# Altium schematic sheet [11] - CONNECTORS.SchDoc: CONNECTORS
size A4; Organization: Bjørn T. Brodtkorb; Address1: Frode Rinnans veg 161; Address2: 7050 Trondheim; DocumentNumber: 6598; Revision: 1.0; SheetNumber: 1; SheetTotal: 1
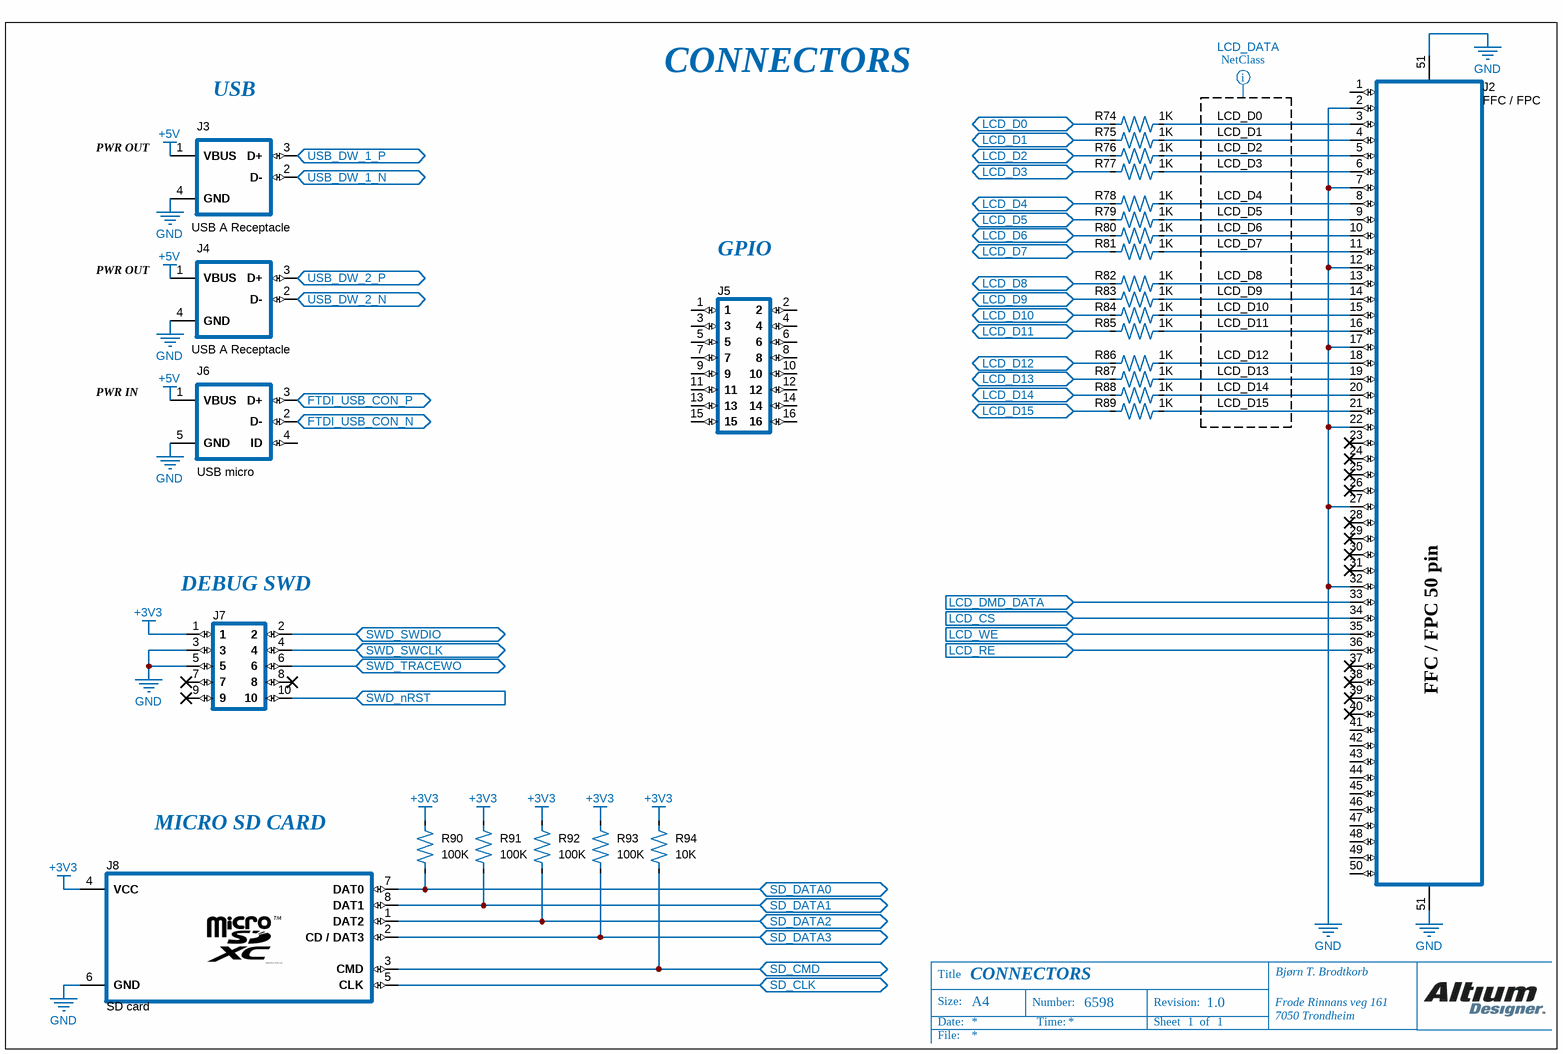
[diagram p0: [11] - CONNECTORS.SchDoc]

## Parts
J2  FFC / FPC  [5-1734592-0]
J3  USB A Receptacle  [USB A Socket]
J4  USB A Receptacle  [USB A Socket]
J5  123-34-2234_14  [Header 2x8 male]  (value not drawn)
J6  USB micro  [USB micro]
J7  123-34-2234_11_1  [Header 2x5 male 1.27mm]  (value not drawn)
J8  SD card  [47219-2001]
R74  value 1K  [R0402]  (hidden comment: CRCW04020000Z0ED)
R75  value 1K  [R0402]  (hidden comment: CRCW04020000Z0ED)
R76  value 1K  [R0402]  (hidden comment: CRCW04020000Z0ED)
R77  value 1K  [R0402]  (hidden comment: CRCW04020000Z0ED)
R78  value 1K  [R0402]  (hidden comment: CRCW04020000Z0ED)
R79  value 1K  [R0402]  (hidden comment: CRCW04020000Z0ED)
R80  value 1K  [R0402]  (hidden comment: CRCW04020000Z0ED)
R81  value 1K  [R0402]  (hidden comment: CRCW04020000Z0ED)
R82  value 1K  [R0402]  (hidden comment: CRCW04020000Z0ED)
R83  value 1K  [R0402]  (hidden comment: CRCW04020000Z0ED)
R84  value 1K  [R0402]  (hidden comment: CRCW04020000Z0ED)
R85  value 1K  [R0402]  (hidden comment: CRCW04020000Z0ED)
R86  value 1K  [R0402]  (hidden comment: CRCW04020000Z0ED)
R87  value 1K  [R0402]  (hidden comment: CRCW04020000Z0ED)
R88  value 1K  [R0402]  (hidden comment: CRCW04020000Z0ED)
R89  value 1K  [R0402]  (hidden comment: CRCW04020000Z0ED)
R90  value 100K  [R0402]  (hidden comment: CRCW04020000Z0ED)
R91  value 100K  [R0402]  (hidden comment: CRCW04020000Z0ED)
R92  value 100K  [R0402]  (hidden comment: CRCW04020000Z0ED)
R93  value 100K  [R0402]  (hidden comment: CRCW04020000Z0ED)
R94  value 10K  [R0402]  (hidden comment: CRCW04020000Z0ED)

## Ports
FTDI_USB_CON_N (bidir), FTDI_USB_CON_P (bidir), LCD_CS (in), LCD_D0 (bidir), LCD_D1 (bidir), LCD_D2 (bidir), LCD_D3 (bidir), LCD_D4 (bidir), LCD_D5 (bidir), LCD_D6 (bidir), LCD_D7 (bidir), LCD_D8 (bidir), LCD_D9 (bidir), LCD_D10 (bidir), LCD_D11 (bidir), LCD_D12 (bidir), LCD_D13 (bidir), LCD_D14 (bidir), LCD_D15 (bidir), LCD_DMD_DATA (in), LCD_RE (in), LCD_WE (in), SD_CLK (bidir), SD_CMD (bidir), SD_DATA0 (bidir), SD_DATA1 (bidir), SD_DATA2 (bidir), SD_DATA3 (bidir), SWD_nRST (in), SWD_SWCLK (bidir), SWD_SWDIO (bidir), SWD_TRACEWO (bidir), USB_DW_1_N (bidir), USB_DW_1_P (bidir), USB_DW_2_N (bidir), USB_DW_2_P (bidir)

## Nets
+3V3: J7.1 J8.4(VCC) R90.2 R91.2 R92.2 R93.2 R94.2
+5V: J3.1(VBUS) J4.1(VBUS) J6.1(VBUS)
GND: J2.2 J2.7 J2.12 J2.17 J2.22 J2.27 J2.32 J2.51 J3.4(GND) J4.4(GND) J6.5(GND) J7.3 J7.5 J8.6(GND)
FTDI_USB_CON_N: J6.2(D-) ; port FTDI_USB_CON_N
FTDI_USB_CON_P: J6.3(D+) ; port FTDI_USB_CON_P
LCD_CS: J2.34 ; port LCD_CS
LCD_D0: J2.3 R74.1
LCD_D0: R74.2 ; port LCD_D0  [a separate net that carries the same name]
LCD_D1: J2.4 R75.1
LCD_D1: R75.2 ; port LCD_D1  [a separate net that carries the same name]
LCD_D2: J2.5 R76.1
LCD_D2: R76.2 ; port LCD_D2  [a separate net that carries the same name]
LCD_D3: J2.6 R77.1
LCD_D3: R77.2 ; port LCD_D3  [a separate net that carries the same name]
LCD_D4: J2.8 R78.1
LCD_D4: R78.2 ; port LCD_D4  [a separate net that carries the same name]
LCD_D5: J2.9 R79.1
LCD_D5: R79.2 ; port LCD_D5  [a separate net that carries the same name]
LCD_D6: J2.10 R80.1
LCD_D6: R80.2 ; port LCD_D6  [a separate net that carries the same name]
LCD_D7: J2.11 R81.1
LCD_D7: R81.2 ; port LCD_D7  [a separate net that carries the same name]
LCD_D8: J2.13 R82.1
LCD_D8: R82.2 ; port LCD_D8  [a separate net that carries the same name]
LCD_D9: J2.14 R83.1
LCD_D9: R83.2 ; port LCD_D9  [a separate net that carries the same name]
LCD_D10: J2.15 R84.1
LCD_D10: R84.2 ; port LCD_D10  [a separate net that carries the same name]
LCD_D11: J2.16 R85.1
LCD_D11: R85.2 ; port LCD_D11  [a separate net that carries the same name]
LCD_D12: J2.18 R86.1
LCD_D12: R86.2 ; port LCD_D12  [a separate net that carries the same name]
LCD_D13: J2.19 R87.1
LCD_D13: R87.2 ; port LCD_D13  [a separate net that carries the same name]
LCD_D14: J2.20 R88.1
LCD_D14: R88.2 ; port LCD_D14  [a separate net that carries the same name]
LCD_D15: J2.21 R89.1
LCD_D15: R89.2 ; port LCD_D15  [a separate net that carries the same name]
LCD_DMD_DATA: J2.33 ; port LCD_DMD_DATA
LCD_RE: J2.36 ; port LCD_RE
LCD_WE: J2.35 ; port LCD_WE
SD_CLK: J8.5(CLK) ; port SD_CLK
SD_CMD: J8.3(CMD) R94.1 ; port SD_CMD
SD_DATA0: J8.7(DAT0) R90.1 ; port SD_DATA0
SD_DATA1: J8.8(DAT1) R91.1 ; port SD_DATA1
SD_DATA2: J8.1(DAT2) R92.1 ; port SD_DATA2
SD_DATA3: J8.2(CD_/_DAT3) R93.1 ; port SD_DATA3
SWD_nRST: J7.10 ; port SWD_nRST
SWD_SWCLK: J7.4 ; port SWD_SWCLK
SWD_SWDIO: J7.2 ; port SWD_SWDIO
SWD_TRACEWO: J7.6 ; port SWD_TRACEWO
USB_DW_1_N: J3.2(D-) ; port USB_DW_1_N
USB_DW_1_P: J3.3(D+) ; port USB_DW_1_P
USB_DW_2_N: J4.2(D-) ; port USB_DW_2_N
USB_DW_2_P: J4.3(D+) ; port USB_DW_2_P

Not connected (* = marked no-connect by the designer): J2 1(55) 23(77)* 24(78)* 25(79)* 26(80)* 28(82)* 29(83)* 30(84)* 31(85)* 37(91)* 38(92)* 39(93)* 40(94)* 41(95) 42(96) 43(97) 44(98) 45(99) 46(100) 47(101) 48(102) 49(103) 50(104); J5 1 2 3 4 5 6 7 8 9 10 11 12 13 14 15 16; J6 4(ID); J7 7* 8* 9*

## Layout directives
net class LCD_DATA: LCD_D0, LCD_D1, LCD_D2, LCD_D3, LCD_D4, LCD_D5, LCD_D6, LCD_D7, LCD_D8, LCD_D9, LCD_D10, LCD_D11, LCD_D12, LCD_D13, LCD_D14, LCD_D15

## Notes on the sheet
- (near J3) USB
- CONNECTORS
- PWR OUT
- (near J5) GPIO
- PWR IN
- (near J7) DEBUG SWD
- (near J8) MICRO SD CARD
- Title
- Size:
- A4
- Number:
- Revision:
- Date:
- File:
- Time:
- Sheet
- of
- (in symbol 5-1734592-0) FFC / FPC 50 pin

## Library data of the parts
J2 = 5-1734592-0: FFC / FPC 50 pins 0.5mm pitch; Supplier 1: Farnell; Supplier Part Number 1: 2528036
J3 J4 = MC32593: USB A; Supplier Part Number 1: 1696534; Supplier 1: Farnell
J5 = 123-34-2234_14: Header 2x8 male 2.54mm
J6 = 47590-0001: USB B micro; Supplier Part Number 1: 1568022; Supplier 1: Farnell
J7 = 123-34-2234_11_1: Header 2x5 male 1.27mm
J8 = 47219-2001: SD micro card; Supplier Part Number 1: 2614940; Supplier 1: Farnell
R74-R94 = CRCW04020000Z0ED: R0402